# Altium project isg_cena_chip_wirebonding_board.PrjPcb
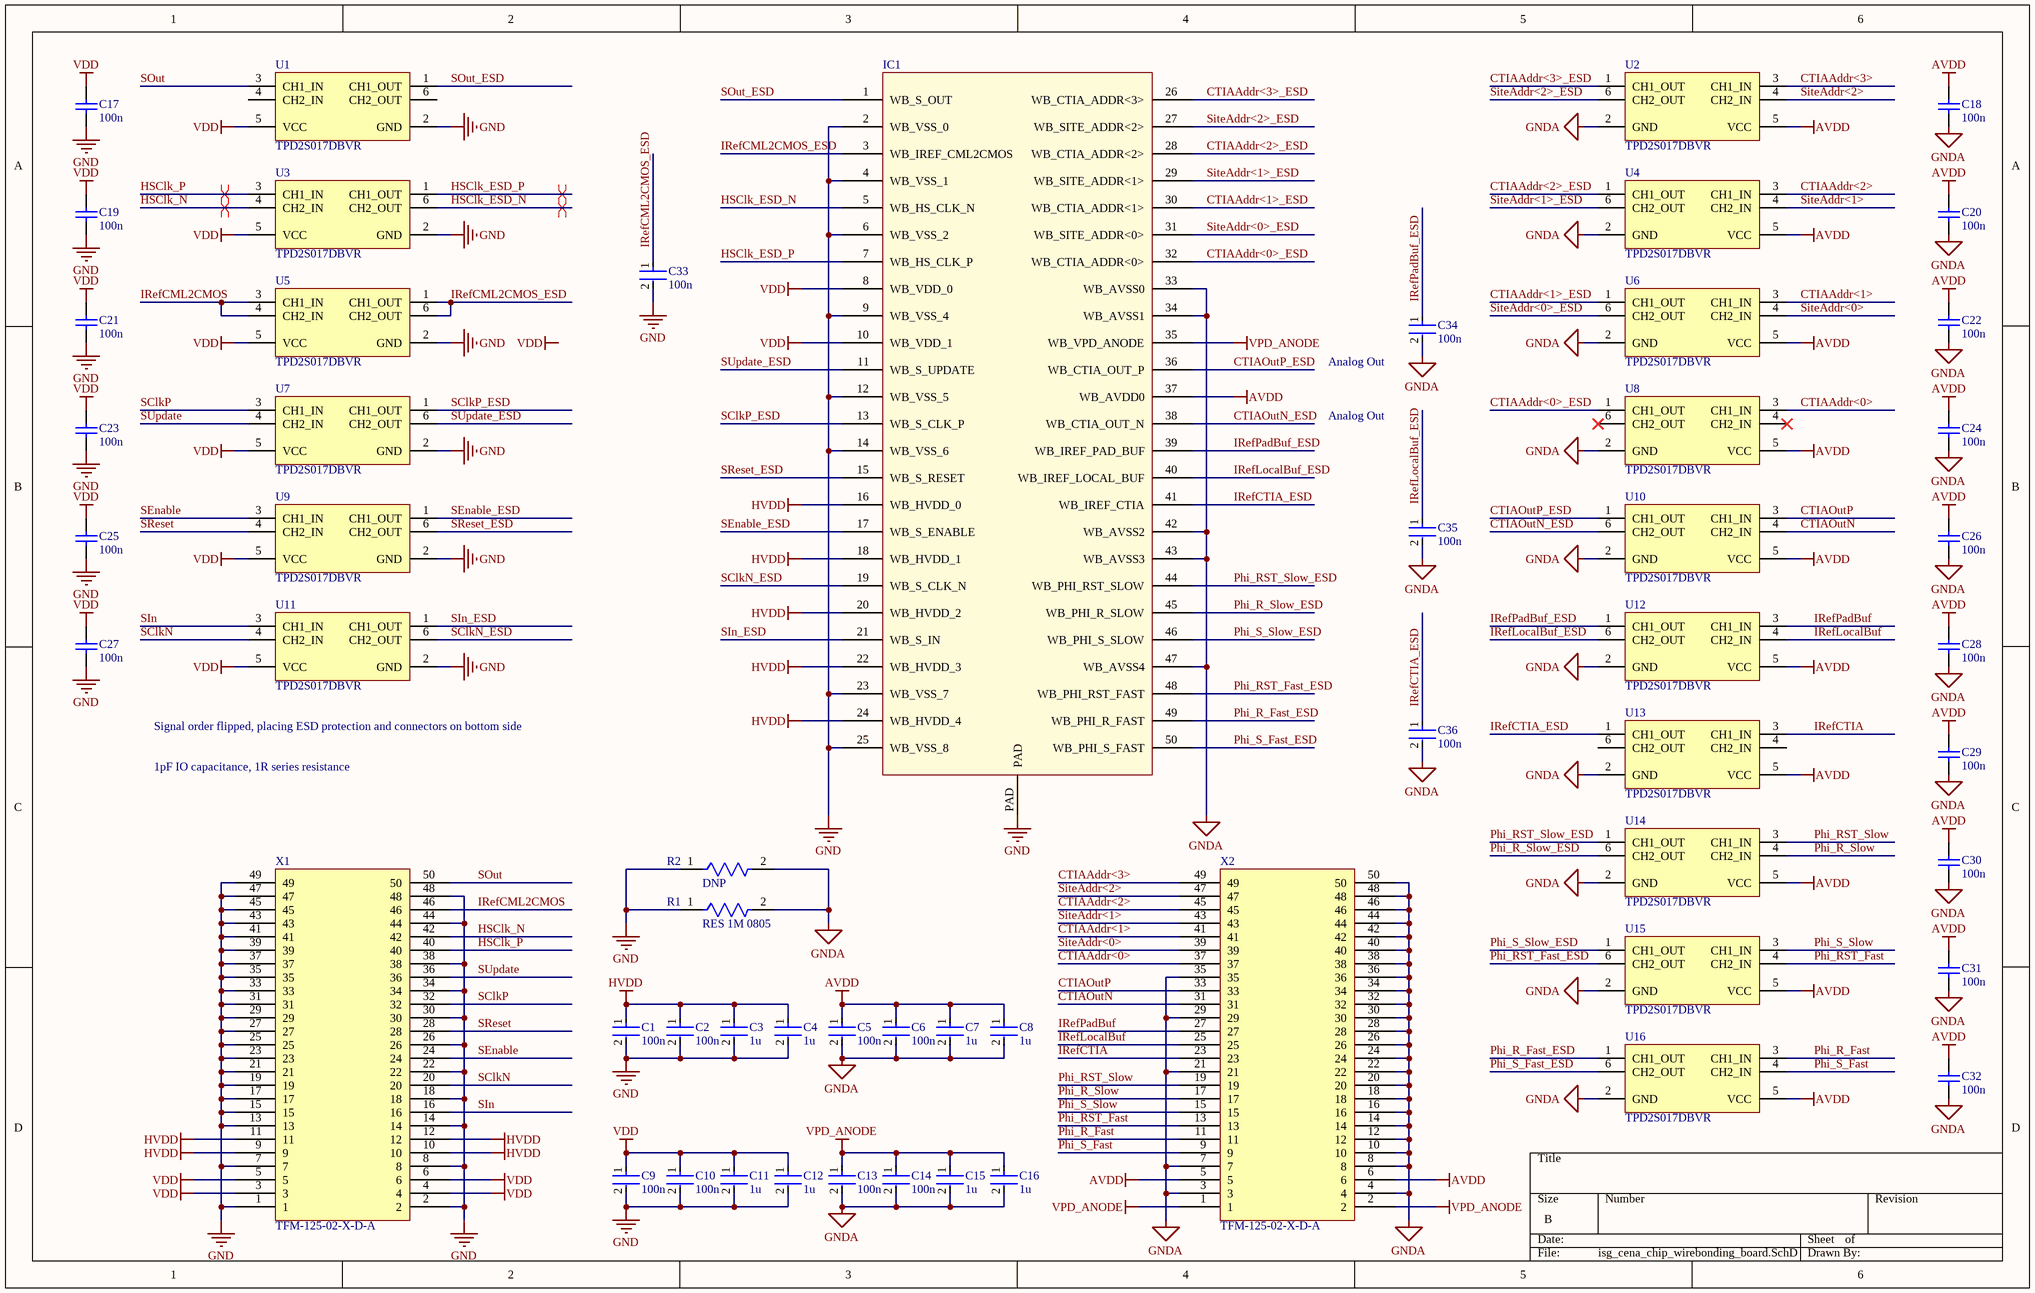
[diagram p0: isg_cena_chip_wirebonding_board.SchDoc]
1 sheet, 57 parts. Net scope: global (net labels, ports and power ports of the same name join across sheets).
Board file: isg_cena_chip_wirebonding_board.PcbDoc

## Sheet isg_cena_chip_wirebonding_board.SchDoc
size B; SheetNumber: 1; SheetTotal: 1

### Parts
C1  100n  [FP-0603-L_1_6_0_15-W_0_8-IPC_C]
C2  100n  [FP-0603-L_1_6_0_15-W_0_8-IPC_C]
C3  1u  [FP-0603-L_1_6_0_15-W_0_8-IPC_C]
C4  1u  [FP-0603-L_1_6_0_15-W_0_8-IPC_C]
C5  100n  [FP-0603-L_1_6_0_15-W_0_8-IPC_C]
C6  100n  [FP-0603-L_1_6_0_15-W_0_8-IPC_C]
C7  1u  [FP-0603-L_1_6_0_15-W_0_8-IPC_C]
C8  1u  [FP-0603-L_1_6_0_15-W_0_8-IPC_C]
C9  100n  [FP-0603-L_1_6_0_15-W_0_8-IPC_C]
C10  100n  [FP-0603-L_1_6_0_15-W_0_8-IPC_C]
C11  1u  [FP-0603-L_1_6_0_15-W_0_8-IPC_C]
C12  1u  [FP-0603-L_1_6_0_15-W_0_8-IPC_C]
C13  100n  [FP-0603-L_1_6_0_15-W_0_8-IPC_C]
C14  100n  [FP-0603-L_1_6_0_15-W_0_8-IPC_C]
C15  1u  [FP-0603-L_1_6_0_15-W_0_8-IPC_C]
C16  1u  [FP-0603-L_1_6_0_15-W_0_8-IPC_C]
C17  100n  [CAPC1050X55X23ML05T13]
C18  100n  [CAPC1050X55X23ML05T13]
C19  100n  [CAPC1050X55X23ML05T13]
C20  100n  [CAPC1050X55X23ML05T13]
C21  100n  [CAPC1050X55X23ML05T13]
C22  100n  [CAPC1050X55X23ML05T13]
C23  100n  [CAPC1050X55X23ML05T13]
C24  100n  [CAPC1050X55X23ML05T13]
C25  100n  [CAPC1050X55X23ML05T13]
C26  100n  [CAPC1050X55X23ML05T13]
C27  100n  [CAPC1050X55X23ML05T13]
C28  100n  [CAPC1050X55X23ML05T13]
C29  100n  [CAPC1050X55X23ML05T13]
C30  100n  [CAPC1050X55X23ML05T13]
C31  100n  [CAPC1050X55X23ML05T13]
C32  100n  [CAPC1050X55X23ML05T13]
C33  100n  [FP-0603-L_1_6_0_15-W_0_8-IPC_C]
C34  100n  [FP-0603-L_1_6_0_15-W_0_8-IPC_C]
C35  100n  [FP-0603-L_1_6_0_15-W_0_8-IPC_C]
C36  100n  [FP-0603-L_1_6_0_15-W_0_8-IPC_C]
IC1  (no value)  [Cena_WB_4/4]
R1  RES 1M 0805  [FP-ERJ6EN-IPC_A]
R2  DNP  [FP-ERJ6EN-IPC_A]
U1  TPD2S017DBVR  [DBV0006A_L]
U2  TPD2S017DBVR  [DBV0006A_L]
U3  TPD2S017DBVR  [DBV0006A_L]
U4  TPD2S017DBVR  [DBV0006A_L]
U5  TPD2S017DBVR  [DBV0006A_L]
U6  TPD2S017DBVR  [DBV0006A_L]
U7  TPD2S017DBVR  [DBV0006A_L]
U8  TPD2S017DBVR  [DBV0006A_L]
U9  TPD2S017DBVR  [DBV0006A_L]
U10  TPD2S017DBVR  [DBV0006A_L]
U11  TPD2S017DBVR  [DBV0006A_L]
U12  TPD2S017DBVR  [DBV0006A_L]
U13  TPD2S017DBVR  [DBV0006A_L]
U14  TPD2S017DBVR  [DBV0006A_L]
U15  TPD2S017DBVR  [DBV0006A_L]
U16  TPD2S017DBVR  [DBV0006A_L]
X1  TFM-125-02-X-D-A  [SAMTEC-TFM-125-02-X-D-A]
X2  TFM-125-02-X-D-A  [SAMTEC-TFM-125-02-X-D-A]

### Nets
AVDD: C5.1 C6.1 C7.1 C8.1 C18.1 C20.1 C22.1 C24.1 C26.1 C28.1 C29.1 C30.1 C31.1 C32.1 IC1.37(WB_AVDD0) U2.5(VCC) U4.5(VCC) U6.5(VCC) U8.5(VCC) U10.5(VCC) U12.5(VCC) U13.5(VCC) U14.5(VCC) U15.5(VCC) U16.5(VCC) X2.5 X2.6
GND: C1.2 C2.2 C3.2 C4.2 C9.2 C10.2 C11.2 C12.2 C17.2 C19.2 C21.2 C23.2 C25.2 C27.2 C33.2 IC1.2(WB_VSS_0) IC1.4(WB_VSS_1) IC1.6(WB_VSS_2) IC1.9(WB_VSS_4) IC1.12(WB_VSS_5) IC1.14(WB_VSS_6) IC1.23(WB_VSS_7) IC1.25(WB_VSS_8) IC1.PAD R1.1 R2.1 U1.2(GND) U3.2(GND) U5.2(GND) U7.2(GND) U9.2(GND) U11.2(GND) X1.1 X1.2 X1.7 X1.8 X1.13 X1.14 X1.15 X1.17 X1.18 X1.19 X1.21 X1.22 X1.23 X1.25 X1.26 X1.27 X1.29 X1.30 X1.31 X1.33 X1.34 X1.35 X1.37 X1.38 X1.39 X1.41 X1.43 X1.44 X1.45 X1.47 X1.48 X1.49
GNDA: C5.2 C6.2 C7.2 C8.2 C13.2 C14.2 C15.2 C16.2 C18.2 C20.2 C22.2 C24.2 C26.2 C28.2 C29.2 C30.2 C31.2 C32.2 C34.2 C35.2 C36.2 IC1.33(WB_AVSS0) IC1.34(WB_AVSS1) IC1.42(WB_AVSS2) IC1.43(WB_AVSS3) IC1.47(WB_AVSS4) R1.2 R2.2 U2.2(GND) U4.2(GND) U6.2(GND) U8.2(GND) U10.2(GND) U12.2(GND) U13.2(GND) U14.2(GND) U15.2(GND) U16.2(GND) X2.3 X2.4 X2.7 X2.8 X2.10 X2.12 X2.14 X2.16 X2.18 X2.20 X2.21 X2.22 X2.24 X2.26 X2.28 X2.29 X2.30 X2.32 X2.34 X2.35 X2.36 X2.38 X2.40 X2.42 X2.44 X2.46 X2.48 X2.50
HVDD: C1.1 C2.1 C3.1 C4.1 IC1.16(WB_HVDD_0) IC1.18(WB_HVDD_1) IC1.20(WB_HVDD_2) IC1.22(WB_HVDD_3) IC1.24(WB_HVDD_4) X1.9 X1.10 X1.11 X1.12
VDD: C9.1 C10.1 C11.1 C12.1 C17.1 C19.1 C21.1 C23.1 C25.1 C27.1 IC1.8(WB_VDD_0) IC1.10(WB_VDD_1) U1.5(VCC) U3.5(VCC) U5.5(VCC) U7.5(VCC) U9.5(VCC) U11.5(VCC) X1.3 X1.4 X1.5 X1.6
VPD_ANODE: C13.1 C14.1 C15.1 C16.1 IC1.35(WB_VPD_ANODE) X2.1 X2.2
CTIAAddr<0>: U8.3(CH1_IN) X2.37
CTIAAddr<0>_ESD: IC1.32(WB_CTIA_ADDR<0>) U8.1(CH1_OUT)
CTIAAddr<1>: U6.3(CH1_IN) X2.41
CTIAAddr<1>_ESD: IC1.30(WB_CTIA_ADDR<1>) U6.1(CH1_OUT)
CTIAAddr<2>: U4.3(CH1_IN) X2.45
CTIAAddr<2>_ESD: IC1.28(WB_CTIA_ADDR<2>) U4.1(CH1_OUT)
CTIAAddr<3>: U2.3(CH1_IN) X2.49
CTIAAddr<3>_ESD: IC1.26(WB_CTIA_ADDR<3>) U2.1(CH1_OUT)
CTIAOutN: U10.4(CH2_IN) X2.31
CTIAOutN_ESD: IC1.38(WB_CTIA_OUT_N) U10.6(CH2_OUT)
CTIAOutP: U10.3(CH1_IN) X2.33
CTIAOutP_ESD: IC1.36(WB_CTIA_OUT_P) U10.1(CH1_OUT)
HSClk_ESD_N: IC1.5(WB_HS_CLK_N) U3.6(CH2_OUT)
HSClk_ESD_P: IC1.7(WB_HS_CLK_P) U3.1(CH1_OUT)
HSClk_N: U3.4(CH2_IN) X1.42
HSClk_P: U3.3(CH1_IN) X1.40
IRefCML2CMOS: U5.3(CH1_IN) U5.4(CH2_IN) X1.46
IRefCML2CMOS_ESD: C33.1 IC1.3(WB_IREF_CML2CMOS) U5.1(CH1_OUT) U5.6(CH2_OUT)
IRefCTIA: U13.3(CH1_IN) X2.23
IRefCTIA_ESD: C36.1 IC1.41(WB_IREF_CTIA) U13.1(CH1_OUT)
IRefLocalBuf: U12.4(CH2_IN) X2.25
IRefLocalBuf_ESD: C35.1 IC1.40(WB_IREF_LOCAL_BUF) U12.6(CH2_OUT)
IRefPadBuf: U12.3(CH1_IN) X2.27
IRefPadBuf_ESD: C34.1 IC1.39(WB_IREF_PAD_BUF) U12.1(CH1_OUT)
Phi_R_Fast: U16.3(CH1_IN) X2.11
Phi_R_Fast_ESD: IC1.49(WB_PHI_R_FAST) U16.1(CH1_OUT)
Phi_R_Slow: U14.4(CH2_IN) X2.17
Phi_R_Slow_ESD: IC1.45(WB_PHI_R_SLOW) U14.6(CH2_OUT)
Phi_RST_Fast: U15.4(CH2_IN) X2.13
Phi_RST_Fast_ESD: IC1.48(WB_PHI_RST_FAST) U15.6(CH2_OUT)
Phi_RST_Slow: U14.3(CH1_IN) X2.19
Phi_RST_Slow_ESD: IC1.44(WB_PHI_RST_SLOW) U14.1(CH1_OUT)
Phi_S_Fast: U16.4(CH2_IN) X2.9
Phi_S_Fast_ESD: IC1.50(WB_PHI_S_FAST) U16.6(CH2_OUT)
Phi_S_Slow: U15.3(CH1_IN) X2.15
Phi_S_Slow_ESD: IC1.46(WB_PHI_S_SLOW) U15.1(CH1_OUT)
SClkN: U11.4(CH2_IN) X1.20
SClkN_ESD: IC1.19(WB_S_CLK_N) U11.6(CH2_OUT)
SClkP: U7.3(CH1_IN) X1.32
SClkP_ESD: IC1.13(WB_S_CLK_P) U7.1(CH1_OUT)
SEnable: U9.3(CH1_IN) X1.24
SEnable_ESD: IC1.17(WB_S_ENABLE) U9.1(CH1_OUT)
SIn: U11.3(CH1_IN) X1.16
SIn_ESD: IC1.21(WB_S_IN) U11.1(CH1_OUT)
SiteAddr<0>: U6.4(CH2_IN) X2.39
SiteAddr<0>_ESD: IC1.31(WB_SITE_ADDR<0>) U6.6(CH2_OUT)
SiteAddr<1>: U4.4(CH2_IN) X2.43
SiteAddr<1>_ESD: IC1.29(WB_SITE_ADDR<1>) U4.6(CH2_OUT)
SiteAddr<2>: U2.4(CH2_IN) X2.47
SiteAddr<2>_ESD: IC1.27(WB_SITE_ADDR<2>) U2.6(CH2_OUT)
SOut: U1.3(CH1_IN) X1.50
SOut_ESD: IC1.1(WB_S_OUT) U1.1(CH1_OUT)
SReset: U9.4(CH2_IN) X1.28
SReset_ESD: IC1.15(WB_S_RESET) U9.6(CH2_OUT)
SUpdate: U7.4(CH2_IN) X1.36
SUpdate_ESD: IC1.11(WB_S_UPDATE) U7.6(CH2_OUT)

Not connected (* = marked no-connect by the designer): U1 4(CH2_IN) 6(CH2_OUT); U8 4(CH2_IN)* 6(CH2_OUT)*; U13 4(CH2_IN) 6(CH2_OUT)

### Layout directives
differential pair: HSClk_ESD_N, HSClk_ESD_P, HSClk_N, HSClk_P

### Notes on the sheet
- (near C34) Analog Out
- Analog Out
- Signal order flipped, placing ESD protection and connectors on bottom side
- 1pF IO capacitance, 1R series resistance
- Labels drawn without touching a wire or pin: VDD

### Library data of the parts
C1-C16 C33-C36 = CMP-2000-07531-4: Ceramic Capacitor General Use 1uF ±10% 50V X7R 0603; Series: M; Width: 0.031inch; Mount: Surface Mount; Radiation Hardening: No; Voltage Rating (DC): 50V; Packaging: Tape and Reel; Termination: SMD/SMT; Depth: 0.8mm; Case Code (Metric): 1608; Case Code (Imperial): 0603; Height: 0.8mm; Voltage Rating: 50V; Package Quantity: 1; Halogen Free: Halogen Free; Dielectric: X7R; Min Operating Temperature: -55°C; Length: 1.6mm; Construction: Flat; Tolerance: 10%; Thickness: 0.037inch; Max Operating Temperature: 125°C; Case/Package: 0603; Capacitance: 1uF; RoHS Compliant: Yes
C17-C32 = CMP-2000-05439-1: Chip Capacitor, 100 nF, +/- 10%, 16 V, -55 to 125 degC, 0402 (1005 Metric), RoHS, Tape and Reel; Manufacturer: Samsung Electro-Mechanics; Capacitance: 100000pF; Dielectric: X7R; Rated Voltage: 16V; Case Size/Dimension: 0402; Tolerance (%): ±10%; Manufacturer URL: http://www.samsungsem.com/global/index.jsp; Datasheet URL: https://datasheet.ciiva.com/29198/458718-da-01-en-vs-kondensator-0402-29198423.pdf; Datasheet Version: Nov-10
IC1 = Cena
R1 = CMP-2001-04378-6: RES SMD 1M OHM 1% 1/8W 0805; Temperature Coefficient: 100ppm/°C; Resistance: 1MR; Power Rating: 125mW; Voltage Rating: 150V; Length: 2mm; Height: 0.6mm; Technology: THICK FILM; Max Operating Temperature: 155°C; Case Code (Metric): 2012; Number of Terminations: 2; Radiation Hardening: No; Package Quantity: 1; Case Code (Imperial): 0805; Tolerance: 1%; RoHS Compliant: Yes; Contact Plating: Tin; Case/Package: 0805; Max Power Dissipation: 125mW; REACH SVHC: No SVHC; Lead Free: Lead Free; Termination: SMD/SMT; Size Code: 0805; Resistance Tolerance: 1%; Construction: Rectangular; Series: ERJ; Resistor Type: Thick Film; Depth: 1.25mm; Packaging: Tape and Reel; Min Operating Temperature: -55°C; Mount: Surface Mount; Features: Automotive AEC-Q200; Voltage Rating (DC): 150V; Military Standard: Not; Width: 1.2mm; Number of Pins: 2
R2 = CMP-2001-04378-6: Temperature Coefficient: 100ppm/°C; Resistance: 1MR; Tolerance: 1%; Power Rating: 125mW; Voltage Rating: 150V; Length: 2mm; Height: 0.6mm; Technology: THICK FILM; Max Operating Temperature: 155°C; Case Code (Metric): 2012; Number of Terminations: 2; Radiation Hardening: No; Package Quantity: 1; Case Code (Imperial): 0805; RoHS Compliant: Yes; Contact Plating: Tin; Case/Package: 0805; Max Power Dissipation: 125mW; REACH SVHC: No SVHC; Lead Free: Lead Free; Termination: SMD/SMT; Size Code: 0805; Resistance Tolerance: 1%; Construction: Rectangular; Series: ERJ; Resistor Type: Thick Film; Depth: 1.25mm; Packaging: Tape and Reel; Min Operating Temperature: -55°C; Mount: Surface Mount; Features: Automotive AEC-Q200; Voltage Rating (DC): 150V; Military Standard: Not; Width: 1.2mm; Number of Pins: 2
U1-U16 = CMP-0326-00057-3: Ultra-Low Clamp Voltage ESD Solution with Series-Resistor Isolation, 2 Channels, -40 to 85 degC, 6-pin SOT-23 (DBV), Green (RoHS & no Sb/Br); Manufacturer: Texas Instruments; IO Capacitance(Typ)(pF): 1; USB High Speed: TRUE; Differential Capacitance(pF): 0.02; IO Leakage Current(nA): 10; Breakdown Voltage(Min)(V): 11; Mounting Technology: Surface Mount; ComponentLink3URL: SamplesURL:http://www.ti.com/product/tpd2s017#samples; USB Full Speed: TRUE; PartNumber: TPD2S017DBVR; ComponentLink2Description: Datasheet; PackageReference: DBV0006A; ComponentLink3Description: URL Link1; DatasheetVersion: SLLS949; SubFamily: ESD Solution; Eco-Plan: Green (RoHS & no Sb/Br); ComponentLink2URL: http://www.ti.com/general/docs/lit/getliterature.tsp?genericPartNumber=TPD2S017&fileType=pdf; PackageDescription: 6-Pin Plastic Small-Outline Package, 2.9 x 1.6 mm Body, 0.95 mm Pitch, 2.8 mm Lead Span; ComponentLink1URL: http://www.ti.com/; PackageVersion: revK, Mar-2006; ComponentLink1Description: Manufacturer URL; IEC 61000-4-2 Contact(+/- kV): 11
X1 X2 = TFM-125-02-X-D-A: SAMTEC TFM-125-02-X-D-A